# Altium schematic sheet Power.SchDoc
size 431 x 279 mm; SheetNumber: 2; SheetTotal: 4
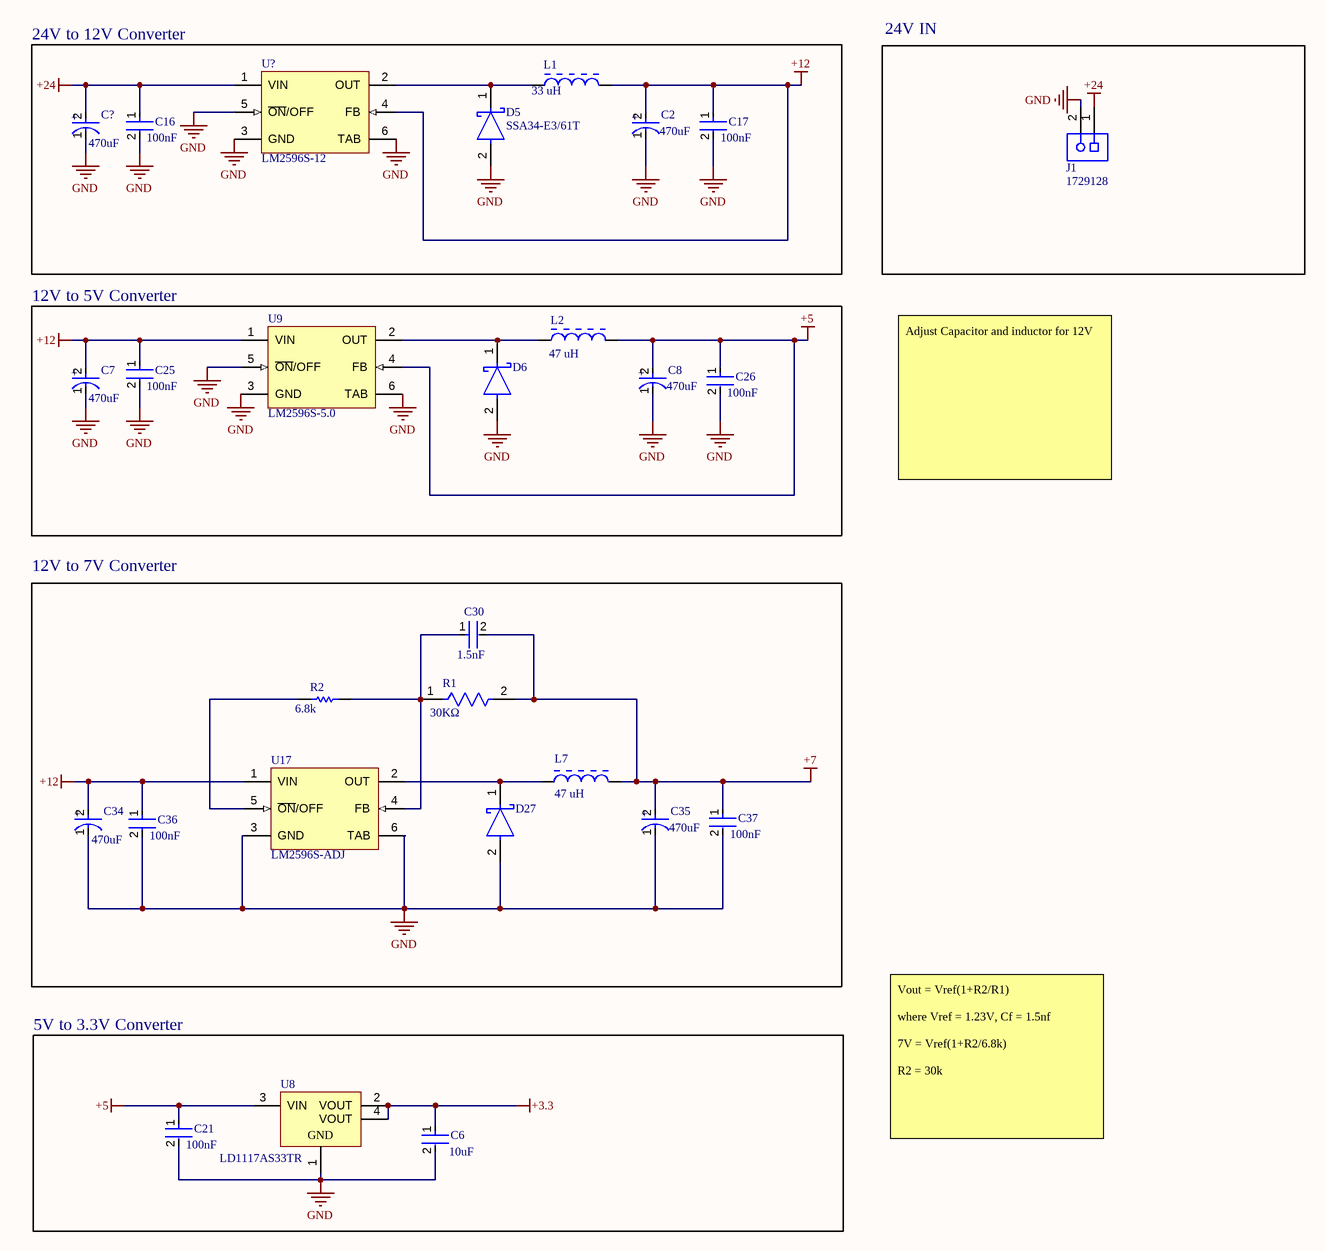
[diagram p0: Power.SchDoc]

## Parts
C2  Capacitance: 470uF  [FP-FTF-MFG]  (hidden comment: EEEFT1E471AP)
C6  Capacitance: 10uF  [FP-GRM188-0_1-e0_2_0_55-IPC_A]  (hidden comment: GRM188R60J106ME47D)
C7  Capacitance: 470uF  [FP-FTF-MFG]  (hidden comment: EEEFT1E471AP)
C8  Capacitance: 470uF  [FP-FTF-MFG]  (hidden comment: EEEFT1E471AP)
C16  Capacitance: 100nF  [FP-CGA3E-0_3-0_1-IPC_A]  (hidden comment: CGA3E2X7R1H104K080AA)
C17  Capacitance: 100nF  [FP-CGA3E-0_3-0_1-IPC_A]  (hidden comment: CGA3E2X7R1H104K080AA)
C21  Capacitance: 100nF  [FP-CGA3E-0_3-0_1-IPC_A]  (hidden comment: CGA3E2X7R1H104K080AA)
C25  Capacitance: 100nF  [FP-CGA3E-0_3-0_1-IPC_A]  (hidden comment: CGA3E2X7R1H104K080AA)
C26  Capacitance: 100nF  [FP-CGA3E-0_3-0_1-IPC_A]  (hidden comment: CGA3E2X7R1H104K080AA)
C30  Capacitance: 1.5nF  [FP-0603-L_1_6_0_1-W_0_8_0-IPC_A]  (hidden comment: UMK107SD152KA-T)
C34  Capacitance: 470uF  [FP-FTF-MFG]  (hidden comment: EEEFT1E471AP)
C35  Capacitance: 470uF  [FP-FTF-MFG]  (hidden comment: EEEFT1E471AP)
C36  Capacitance: 100nF  [FP-CGA3E-0_3-0_1-IPC_A]  (hidden comment: CGA3E2X7R1H104K080AA)
C37  Capacitance: 100nF  [FP-CGA3E-0_3-0_1-IPC_A]  (hidden comment: CGA3E2X7R1H104K080AA)
C?  Capacitance: 470uF  [FP-FTF-MFG]  (hidden comment: EEEFT1E471AP)
D5  SSA34-E3/61T  [FP-95400-MFG]
D6  SSA34-E3/61T  [FP-95400-MFG]  (value not drawn)
D27  SSA34-E3/61T  [FP-95400-MFG]  (value not drawn)
J1  1729128  [PHOE-1729128-2_V]
L1  Inductance: 33 uH  [BOUR-SRN3015-2_V]  (hidden comment: SRN3015-330M)
L2  Inductance: 47 uH  [BOUR-SRN3015-2_V]  (hidden comment: SRN3015-470M)
L7  Inductance: 47 uH  [BOUR-SRN3015-2_V]  (hidden comment: SRN3015-470M)
R1  value 30KΩ  [FP-RT0603-MFG]  (hidden comment: RT0603FRE0730KL)
R2  value 6.8k  [RESC1609X50X30LL10T20]  (hidden comment: CRCW06036K80FKEA)
U8  LD1117AS33TR  [SOT-223_M]
U9  LM2596S-5.0  [KTT0005B_L]
U17  LM2596S-ADJ  [TS5B_L]
U?  LM2596S-12  [TS5B_N]

## Blocks framed on the sheet
24V to 12V Converter: C2 C16 C17 C? D5 L1 U?
24V IN: J1
12V to 5V Converter: C7 C8 C25 C26 D6 L2 U9
12V to 7V Converter: C30 C34-C37 D27 L7 R1 R2 U17
5V to 3.3V Converter: C6 C21 U8

## Nets
+3.3: C6.1 U8.2(VOUT) U8.4(VOUT)
+5: C8.2(A) C21.1 C26.1 L2.2 U8.3(VIN) U9.4(FB)
+7: C30.2 C35.2(A) C37.1 L7.2 R1.2
+12: C2.2(A) C7.2(A) C17.1 C25.1 C34.2(A) C36.1 L1.2 U9.1(VIN) U17.1(VIN) U?.4(FB)
+24: C16.1 C?.2(A) J1.1 U?.1(VIN)
GND: C2.1(C) C6.2 C7.1(C) C8.1(C) C16.2 C17.2 C21.2 C25.2 C26.2 C34.1(C) C35.1(C) C36.2 C37.2 C?.1(C) D5.2(A) D6.2(A) D27.2(A) J1.2 U8.1(GND) U9.3(GND) U9.5(~{ON}/OFF) U9.6(TAB) U17.3(GND) U17.6(TAB) U?.3(GND) U?.5(~{ON}/OFF) U?.6(TAB)
NetC30_1: C30.1 R1.1 R2.2 U17.4(FB)
NetD5_1: D5.1(C) L1.1 U?.2(OUT)
NetD6_1: D6.1(C) L2.1 U9.2(OUT)
NetD27_1: D27.1(C) L7.1 U17.2(OUT)
NetR2_1: R2.1 U17.5(~{ON}/OFF)

## Notes on the sheet
- Adjust Capacitor and inductor for 12V
- Vout = Vref(1+R2/R1)
  where Vref = 1.23V, Cf = 1.5nf
  7V = Vref(1+R2/6.8k)
  R2 = 30k
- DWG. NO.
- REV.
- SHT.
- THIS DOCUMENT AND THE DATA DISCLOSED HEREIN OR HEREWITH IS THE PROPERTY OF ALTIUM LIMITED AND MAY BE FREELY DISTRIBUTED IN WHOLE. NO RIGHTS ARE RESERVED OR EXPRESS OR IMPLIED WARANTEE GIVEN.
- REVISION
- DESCRIPTION
- DATE
- APPROVED
- ENG:
- APPROVALS
- PROJECT
- DSN:
- CHK:
- REFERENCE DOCUMENTS
- PROJECT REVISION:
- TITLE
- DOCUMENT REVISION:
- DESIGN ITEM:
- BOM:
- FAB DWG:
- PCB DWG:
- ASSY DWG:
- SCALE:
- SIZE
- B
- CAGE CODE
- FILE NAME
- DWG NO.
- SHEET
- OF
- REV
- (in symbol CMP-05427-000040-1) +

## Library data of the parts
C2 C7 C8 C34 C35 C? = CMP-05427-000040-1: CAP ALUM 470UF 20% 25V SMD; ESR (Equivalent Series Resistance): 80mR; Dielectric Material: Aluminium; Lead Diameter: 0.9mm; Ripple Current: 850mA; Leakage Current: 117.5uA; Life (Hours): 2000Hour; Lead Free: Lead Free; Height - Seated (Max): 0.413inch; Contact Plating: Tin; Voltage: 25V; Package Quantity: 500; REACH SVHC: No SVHC; Diameter: 8mm; Features: General Purpose; Voltage Rating: 25V; Radiation Hardening: No; Number of Pins: 2; Length: 10.2mm; Max Operating Temperature: 105°C; Tolerance: 20%; Lead Pitch: 3.1mm; Voltage Rating (DC): 25V; Packaging: Tape and Reel; RoHS Compliant: Yes; Series: FT; Height: 10.2mm; Construction: Cylindrical; Case/Package: Radial; Mount: Surface Mount; Termination: SMD/SMT; Min Operating Temperature: -55°C; Ripple Current (AC): 850mA; LCSC: C178591
C6 = CMP-2006-02792-2: Chip Multilayer Ceramic Capacitors for General Purpose, 0603, 10uF, X5R, 15%, 20%, 6.3V; Packaging: Tape and Reel; Voltage Rating (DC): 6.3V; Width: 0.031inch; Termination: SMD/SMT; Dielectric: X5R; Package Quantity: 4000; Voltage Rating: 6.3V; Case/Package: 0603; Min Operating Temperature: -55°C; Voltage: 6.3V; Length: 1.6mm; Thickness: 0.035inch; Lead Free: Lead Free; Depth: 0.8mm; Case Code (Imperial): 0603; Max Operating Temperature: 85°C; Material: Ceramic; Height: 0.8mm; Tolerance: 20%; Mount: Surface Mount; REACH SVHC: No SVHC; Radiation Hardening: No; Case Code (Metric): 1608; LCSC: C385035
C16 C17 C21 C25 C26 C36 C37 = CMP-2000-07546-2: Cap Ceramic 100nF 50V X7R 10% Pad SMD 0603 +125°C Automotive T/R; Weight: 7.1E-05oz; Composition: Ceramic; Max Operating Temperature: 125°C; Termination: SMD/SMT; Dielectric: X7R; Length: 1.6mm; Package Quantity: 1; REACH SVHC: No SVHC; Lead Free: Lead Free; Case Code (Metric): 1608; Min Operating Temperature: -55°C; Packaging: Tape and Reel; Tolerance: 10%; Voltage Rating: 50V; Case Code (Imperial): 0603; Case/Package: 0603; Voltage Rating (DC): 50V; Depth: 0.8mm; Radiation Hardening: No; Ratings: AEC-Q200; Mount: Surface Mount; Voltage: 50V; Thickness: 0.035inch; Width: 0.8mm; Height: 0.8mm; LCSC: C14663
C30 = CMP-14477-003947-2: None; Tolerance: 10%; Dielectric Material: Ceramic; Voltage Rating (DC): 50V; Case Code (Imperial): 0603; RoHS Compliant: Yes; Mount: Surface Mount; Packaging: Tape and Reel; Height: 0.8mm; Number of Pins: 2; Width: 0.031inch; Min Operating Temperature: -55°C; Depth: 0.8mm; Package Quantity: 4000; Termination: SMD/SMT; Halogen Free: Halogen Free; Length: 0.063inch; Max Operating Temperature: 125°C; Voltage Rating: 50V; Lead Free: Lead Free; Case Code (Metric): 1608; Radiation Hardening: No; Case/Package: 0603; Thickness: 0.035inch; Construction: Flat; Series: CFCAP™
D5 D6 D27 = CMP-02539-000022-2: DIODE SCHOTTKY 40V 3A DO214AC; Element Configuration: Single; Max Reverse Leakage Current: 200uA; Polarity: Standard; Peak Non-Repetitive Surge Current: 75A; Forward Voltage: 490mV; Radiation Hardening: No; Current Rating: 3A; Contact Plating: Tin; Output Current: 3A; Height: 2.087mm; Mount: Surface Mount; Case/Package: SMA; Packaging: Tape and Reel; Width: 2.79mm; Average Rectified Current: 3A; Max Repetitive Reverse Voltage (Vrrm): 40V; Max Operating Temperature: 150°C; Length: 4.5mm; RoHS Compliant: Yes; Max Reverse Current: 200uA; Voltage Rating (DC): 40V; Min Operating Temperature: -65°C; Max Reverse Voltage (DC): 40V; Number of Pins: 2; Max Forward Surge Current (Ifsm): 75A; Lead Free: Lead Free; Forward Current: 3A; Max Surge Current: 75A; Package Quantity: 1; LCSC: C466998
J1 = CMP-2000-05815-1: PCB Terminal Block, 13.5 A, 400 V, 2-Pin THD, RoHS, Bulk; Manufacturer: Phoenix Contact; Package Version: 03/2015; No. of Rows: 1; Pitch: 5.08mm; No. of Positions: 2; Voltage Rating: 400V; Current Rating: 13500mA; Manufacturer URL: http://www.phoenixcontact.com/; Datasheet URL: https://datasheet.ciiva.com/16046/1729128-16046181.pdf; RoHS: TRUE; Package URL: https://www.phoenixcontact.com/online/portal/pi/pxc/product_detail_page/!ut/p/b1/3VdJjqNKFDxLH8AFycySyWY2ozFsEPOMMQaDOX1XedGL_1Vdm5YXJleknhSKeBkvI6EA8ncAo3AYoDhBQGco6KN7VURTdemj9us_IEKEZo_YHiPAEWEFmDGOHMORkqKYCORBZxgL7ZoaZYcbFFUZ3fqxSY6GOuxydWUuHqz1ynmMFygu583Bob0Ewr6Sd_l-5m-kAueHiB0jpRwZwe58wwtkpxtMYd_LmGcDRU02dRNEyWt6Y2ti5pSyJ_reIkzIulrqApdnbT11V5jnCKbYNCvhEM1MCpPByat_X379-iThf08CI5GfOPqfBeS3BRoBOdD55AKVv0iLwCMq-2BrzXWSGRH7pUGD9uwXQjiph3xL0DKQwdGa0JImiIOmBNOestqgwTHSSs2oOep-78apyXQBvNi8ZLaFjvjWvcaUEBu0MC6Wbe-d6mB0FAebo2lUWinqYaZs5DAYzV0RP9yitUjnGJ0iI9xhZkT42OCQNUJJhkgWINNQLP2JFP6OpMg3JCVg70jqHT0lvKOnhHf0lPuOnnLf0VPuWx6_dxwUIvwk5WMkT0kLL1mh61l2yZVSzG3pYV_bqo-mj6uMKwKwdnnW8Jh5RTOJzMOA5c-eJDaZQw4mTMPH02PvS_ZAqNVjVTo2WyYLkwH_KU1mmmG5kjRhDqPXLwwVHvVOjCM60-fpXvTDfMGW1PVFVS1r4e4yVDk4ZdNbkUHvqPqQSeian4UD39fNKmachqdJ1NJbyk8rXT9mXTvPk3oE5meulKGgiruPJek-4I9hTT6G8ZLOyRSm2RRVbThERQad5OS28hdt4YW4vG0stgYYzsWsK4_7y6DZMjJSCqri1kyiZR5vD7pwIrNR7QwPHTcLTI5qT7eRlpHrdGiupYlqQDJ7zy_CND8fWWBoLRXxk1RVcXiBQwbTD4Xi7KL-FuO94t9xaqweXzH; PartNumber: 1729128; Package Description: 2-Pin Through Hole Device, Body 8.1 x 10.16 mm, Pitch 5.08 mm; Datasheet Version: 12/2013; Mounting Technology: ThroughHole; Orientation: Horizontal; Package Reference: 1729128-2; Packing: Bulk
L1 = CMP-0007-00002-1: Semi-shielded Power Inductor, 33 uH, +/- 20%, 0.5 A, -40 to 125 degC, 3 x 3 x 1.5 mm SMD, RoHS and Halogen Free, Tape and Reel; Manufacturer: Bourns; DCR Max: 0.959 Ohm; Resistance to Solder Heat: +260 degC for 10 sec.; Isat: 0.46 A; Rated current: 0.5 A; SRF Min: 22 MHz; Inductance tolerance: +/- 20%; Packing: Tape and Reel; PackageDescription: 2-Pin SMD, Body 3 x 3 mm, Height 1.5 mm; Operating Temperature: -40 to 125 degC; Mounting Technology: Surface Mount; ComponentLink3Description: Package Specification; DatasheetVersion: Aug-11; ComponentLink3URL: http://www.bourns.com/data/global/pdfs/SRN3015.pdf; RoHS: TRUE; PartNumber: SRN3015-330M; ComponentLink2Description: Datasheet; ComponentLink2URL: http://www.bourns.com/data/global/pdfs/SRN3015.pdf; ComponentLink1Description: Manufacturer URL; PackageReference: SRN3015; ComponentLink1URL: http://www.bourns.com/; LCSC: C2903004
L2 L7 = CMP-0007-00006-1: Semi-shielded Power Inductor, 47 uH, +/- 20%, 0.4 A, -40 to 125 degC, 3 x 3 x 1.5 mm SMD, RoHS and Halogen Free, Tape and Reel; Manufacturer: Bourns; DCR Max: 1.406 Ohm; Isat: 0.38 A; Rated current: 0.4 A; Inductance tolerance: +/- 20%; SRF Min: 18 MHz; Resistance to Solder Heat: +260 degC for 10 sec.; ComponentLink1URL: http://www.bourns.com/; ComponentLink1Description: Manufacturer URL; ComponentLink2Description: Datasheet; PackageDescription: 2-Pin SMD, Body 3 x 3 mm, Height 1.5 mm; Packing: Tape and Reel; PackageReference: SRN3015; Mounting Technology: Surface Mount; DatasheetVersion: Aug-11; RoHS: TRUE; ComponentLink3URL: http://www.bourns.com/data/global/pdfs/SRN3015.pdf; PartNumber: SRN3015-470M; ComponentLink2URL: http://www.bourns.com/data/global/pdfs/SRN3015.pdf; Operating Temperature: -40 to 125 degC; ComponentLink3Description: Package Specification; LCSC: C3222246
R1 = CMP-2000-04724-2: RES SMD 30K OHM 1% 1/10W 0603; Manufacturer: Yageo; Tolerance: 0.01; Power Rating: 0.1W; Voltage Rating: 75V; Temperature Coefficient: 50 ppm/°C; Mouser Description: Thin Film Resistors - SMD 1/10W 30K ohm 1% 50ppm; Device Class L1: Passive Components; Temperature Range High: +155°C; Manufacturer Part Number: RT0603FRE0730KL; Device Class L3: Chip SMD Resistors; Temperature: -55°C to +155°C; Resistance: 30KΩ; Octopart: https://octopart.com/rt0603fre0730kl-yageo-1290535; Series: RT; ComponentLink2URL: http://www.yageo.com/documents/recent/PYu-RT_1-to-0.01_RoHS_L_9.pdf; Ipc Land Pattern Name: RESC16080X45; Composition: Thin Film; Category: Res; Device Class L2: Resistors; Footprint Url: http://www.yageo.com/exep/pages/download/literatures/PYu-R_Mount_10.pdf; Temperature Range Low: -55°C; ComponentLink2Description: Datasheet; Package: RT0603; Lead Free: Yes; Height: 0.55mm; Digikey Description: RES SMD 30K OHM 1% 1/10W 0603; Automotive: No; RoHS: TRUE
R2 = CMP-2000-03550-1: Manufacturer: Vishay Dale; Part Number: CRCW06036K80FKEA; LCSC: C269697
U8 = CMP-0244-00316-1: 1A, Low Drop Positive Voltage Regulator, 3.3V, 4-Pin SOT-223, Tape and Reel; ComponentLink1Description: Manufacturer URL; DatasheetVersion: 2/12/2011; PackageVersion: 2010; ComponentLink1URL: http://www.st.com; ComponentLink2Description: Datasheet; ComponentLink2URL: http://www.st.com/internet/com/TECHNICAL_RESOURCES/TECHNICAL_LITERATURE/DATASHEET/CD00002116.pdf; PackageDescription: 4-Pin SOT-223 Package, 6.5 x 3.5 mm Body, 2.3 mm Pitch, 7 mm Lead Span; PackageReference: SOT-223
U9 = CMP-0069-00270-3: SIMPLE SWITCHER® Power Converter 150 KHz 3A Step-Down Voltage Regulator, 5-pin TO-263; Manufacturer: Texas Instruments; PowerWise: N; PackageTopMarking: NSUZXYTTE#*LM2596S*-5.0 P+; RoHS: N; Code_JEDEC: MO-169-AB; PackageDescription: TO-263, Molded, .400 x .390 x .180in, 5 Lead, .067in Pitch, Surface Mount; PinCount: 5; PackageReference: KTT0005B; CompType: Switcher; ComponentLink1URL: http://www.ti.com/general/docs/lit/getliterature.tsp?genericPartNumber=LM2596&fileType=pdf; ComponentLink1Description: Datasheet URL; LCSC: C347421
U17 = CMP-0069-00272-2: SIMPLE SWITCHER® Power Converter 150 KHz 3A Step-Down Voltage Regulator, 5-pin TO-263; Manufacturer: National Semiconductor; PackageTopMarking: NSUZXYTTE#*LM2596S*-ADJ P+; PowerWise: N; ComponentLink1Description: LM2596 Datasheet; RoHS: N; PackageVersion: revD, Apr-2005; DatasheetVersion: May-2002; ComponentLink2Description: LM2596 Web Page; ComponentLink2URL: http://www.national.com/pf/LM/LM2596.html; RevisionNote: Component URLs added; PackageDescription: TO-263, Molded, .400 x .390 x .180in, 5 Lead, .067in Pitch, Surface Mount; ComponentLink3Description: TS5B Package Page; ComponentLink1URL: http://www.national.com/ds/LM/LM2596.pdf; PackageReference: TS5B; Code_JEDEC: MO-169-AB; PinCount: 5; ComponentLink3URL: http://www.national.com/packaging/folders/ts5b.html; CompType: Switcher; LCSC: C5276751
U? = CMP-0069-00274-2: SIMPLE SWITCHER® Power Converter 150 KHz 3A Step-Down Voltage Regulator, 5-pin TO-263; Manufacturer: National Semiconductor; PackageTopMarking: NSUZXYTTE#*LM2596S*-12 P+; PowerWise: N; RoHS: N; ComponentLink3URL: http://www.national.com/packaging/folders/ts5b.html; DatasheetVersion: May-2002; RevisionNote: Component URLs added; CompType: Switcher; Code_JEDEC: MO-169-AB; PackageReference: TS5B; PackageDescription: TO-263, Molded, .400 x .390 x .180in, 5 Lead, .067in Pitch, Surface Mount; PackageVersion: revD, Apr-2005; ComponentLink1Description: LM2596 Datasheet; ComponentLink3Description: TS5B Package Page; ComponentLink1URL: http://www.national.com/ds/LM/LM2596.pdf; ComponentLink2URL: http://www.national.com/pf/LM/LM2596.html; ComponentLink2Description: LM2596 Web Page; PinCount: 5